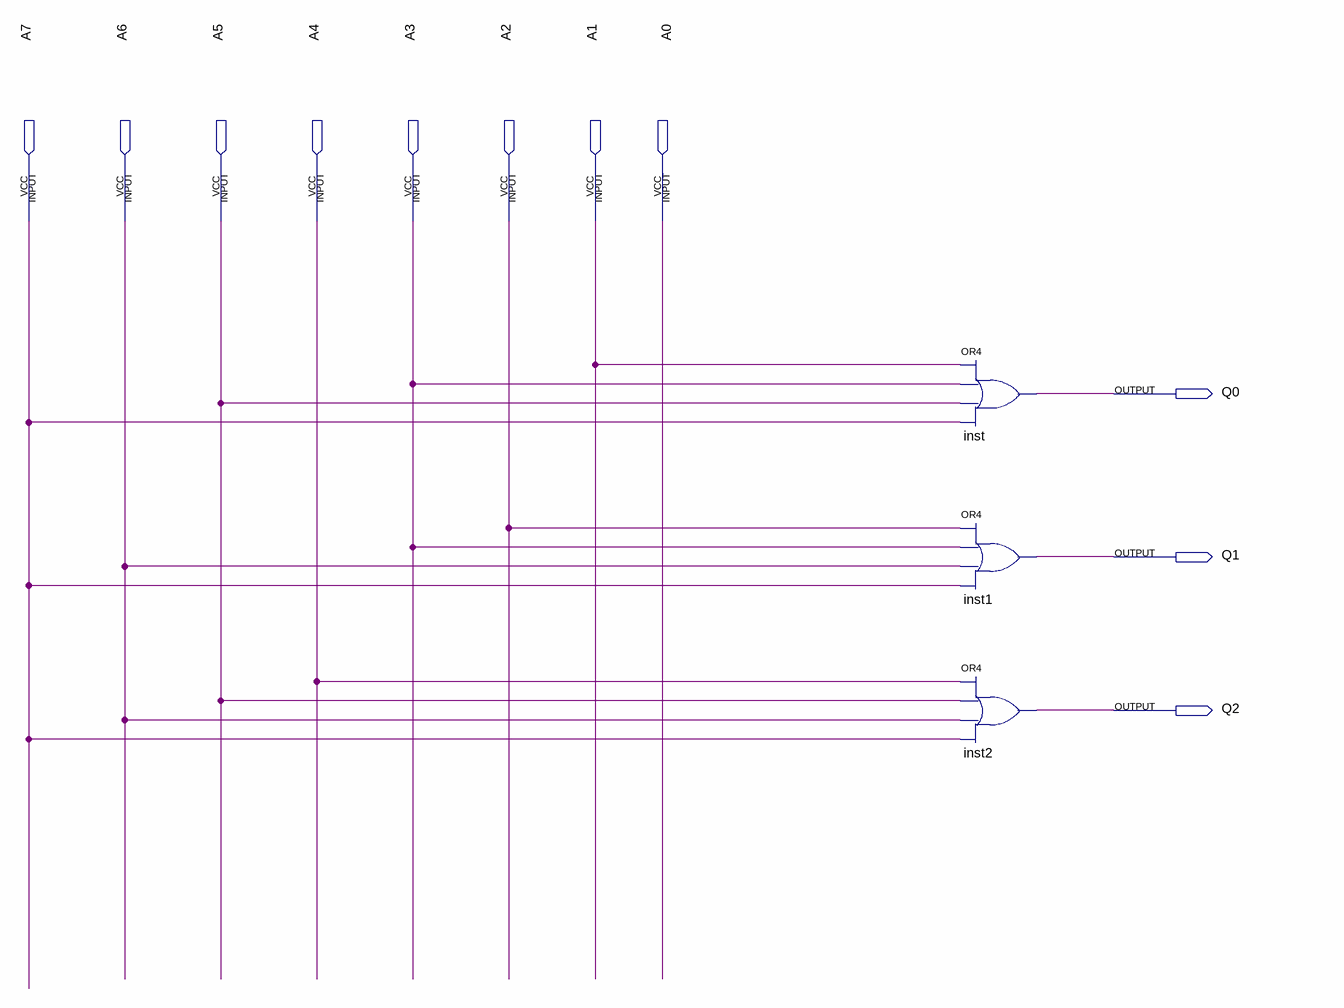
[diagram p0: schematic sheet]
// Quartus schematic encoder.bdf as structural Verilog: 3 symbols, 11 pins
module encoder (
  input  A7,
  input  A6,
  input  A5,
  input  A4,
  input  A3,
  input  A2,
  input  A1,
  input  A0,
  output Q0,
  output Q1,
  output Q2
);

  or inst (Q0, A1, A3, A5, A7);
  or inst1 (Q1, A2, A3, A6, A7);
  or inst2 (Q2, A4, A5, A6, A7);
endmodule
